# Altium project HumanoidMC_Project.PrjPcb
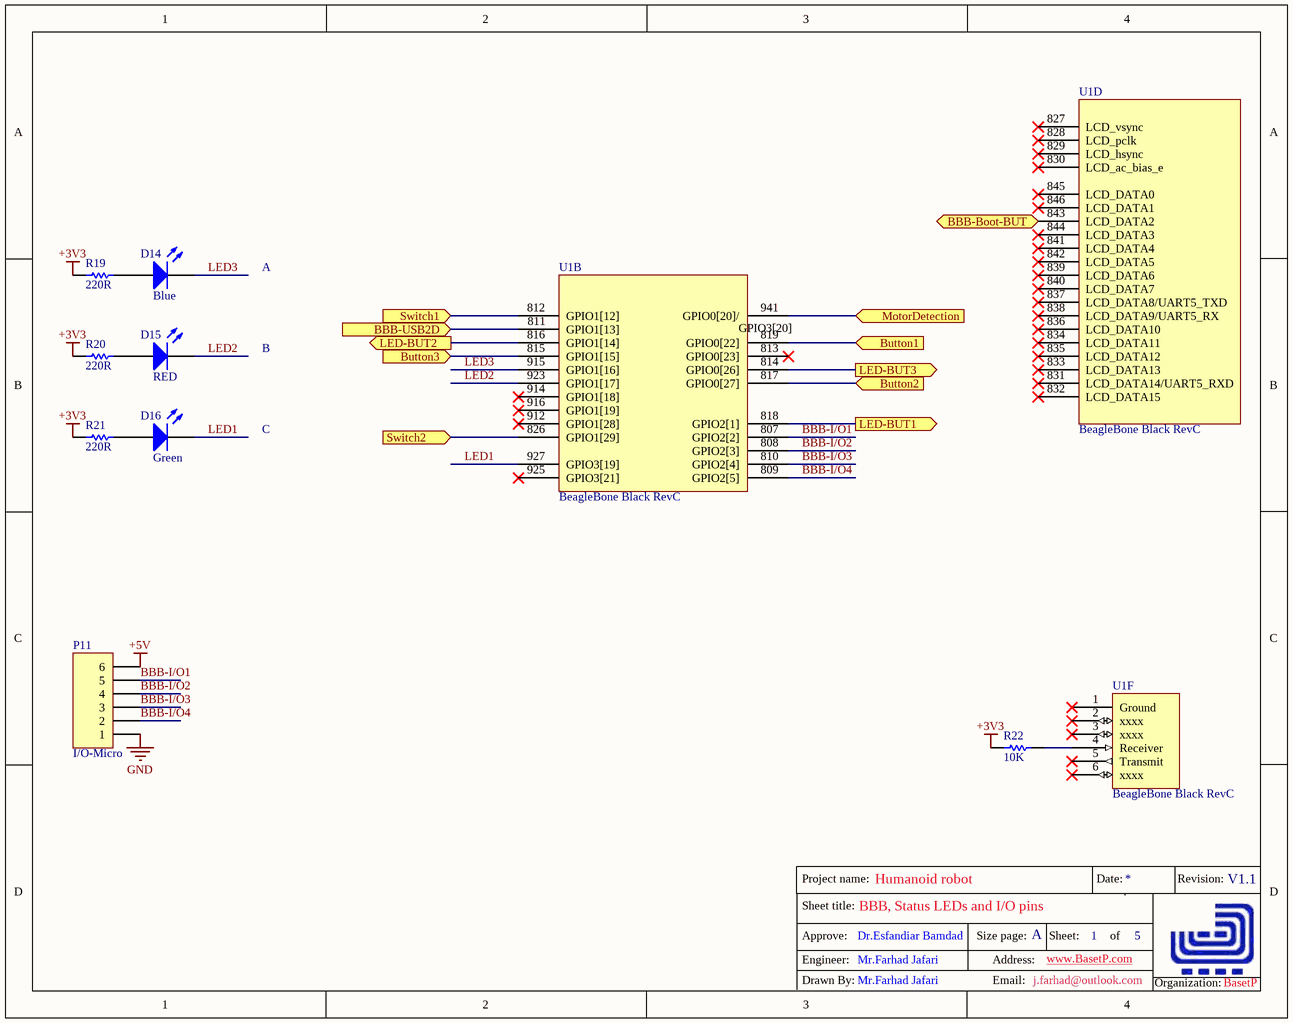
[diagram p0: Main sheet.SchDoc]
5 sheets, 135 parts. Net scope: flat (ports and power ports of the same name join across sheets).
Board file: MainController.PcbDoc
Sheets:
  Main sheet.SchDoc
  Communication sheet.SchDoc
  Switch sheet.SchDoc
  Extension sheet.SchDoc
  Power sheet.SchDoc

## Sheet Main sheet.SchDoc: BBB, Status LEDs and I/O pins
size A; DrawnBy: Mr.Farhad Jafari; Engineer: Mr.Farhad Jafari; Address1: www.BasetP.com; Address2: www.BasetP.com; Address3: www.BasetP.com; Address4: www.BasetP.com; Revision: V1.1; SheetNumber: 1; SheetTotal: 5; ProjectName: Humanoid robot

### Parts
D14  Blue  [led Blue-0805]
D15  RED  [LED Red-0805]
D16  Green  [LED Green-0805]
P11  I/O-Micro  [HDR1X6]
R19  220R  [6-0805]
R20  220R  [6-0805]
R21  220R  [6-0805]
R22  10K  [6-0805]
U1  BeagleBone Black RevC  [BBB-C]  (parts B,D,F of 6)

### Ports
BBB-Boot-BUT (in), BBB-USB2D (in), Button1 (in), Button2 (in), Button3 (in), LED-BUT1 (out), LED-BUT2 (out), LED-BUT3 (out), MotorDetection (in), Switch1 (in), Switch2 (in)

### Nets
+3V3: R19.1 R20.1 R21.1 R22.1
+5V: P11.6
GND: P11.1
BBB-I/O1: P11.5 U1.807(GPIO2[2])
BBB-I/O2: P11.4 U1.808(GPIO2[3])
BBB-I/O3: P11.3 U1.810(GPIO2[4])
BBB-I/O4: P11.2 U1.809(GPIO2[5])
LED1: D16.2(K) U1.927(GPIO3[19])
LED2: D15.2(K) U1.923(GPIO1[17])
LED3: D14.2(K) U1.915(GPIO1[16])
NetC21_2: U1.819(GPIO0[22]) ; port Button1
NetC22_2: U1.817(GPIO0[27]) ; port Button2
NetC23_2: U1.815(GPIO1[15]) ; port Button3
NetD14_1: D14.1(A) R19.2
NetD15_1: D15.1(A) R20.2
NetD16_1: D16.1(A) R21.2
NetD24_2: U1.818(GPIO2[1]) ; port LED-BUT1
NetD26_2: U1.816(GPIO1[14]) ; port LED-BUT2
NetD27_2: U1.814(GPIO0[26]) ; port LED-BUT3
NetQ2_3: U1.941(GPIO0[20]/) ; port MotorDetection
NetR22_2: R22.2 U1.4(Receiver)
NetR48_1: U1.843(LCD_DATA2) ; port BBB-Boot-BUT
NetS3_2: U1.811(GPIO1[13]) ; port BBB-USB2D
NetS5_2: U1.812(GPIO1[12]) ; port Switch1
NetS7_2: U1.826(GPIO1[29]) ; port Switch2

Not connected (* = marked no-connect by the designer): U1 1(Ground)* 2(xxxx)* 3(xxxx)* 5(Transmit)* 6(xxxx)* 813(GPIO0[23])* 827(LCD_vsync)* 828(LCD_pclk)* 829(LCD_hsync)* 830(LCD_ac_bias_e)* 831(LCD_DATA14/UART5_RXD)* 832(LCD_DATA15)* 833(LCD_DATA13)* 834(LCD_DATA11)* 835(LCD_DATA12)* 836(LCD_DATA10)* 837(LCD_DATA8/UART5_TXD)* 838(LCD_DATA9/UART5_RX)* 839(LCD_DATA6)* 840(LCD_DATA7)* 841(LCD_DATA4)* 842(LCD_DATA5)* 844(LCD_DATA3)* 845(LCD_DATA0)* 846(LCD_DATA1)* 912(GPIO1[28])* 914(GPIO1[18])* 916(GPIO1[19])* 925(GPIO3[21])*

### Notes on the sheet
- A
- B
- C
- Sheet title:
- Project name:
- Date:
- Revision:
- Engineer:
- Approve:
- Dr.Esfandiar Bamdad
- Size page:
- Address:
- www.BasetP.com
- Sheet:
- of
- Drawn By:
- Mr.Farhad Jafari
- Email:
- j.farhad@outlook.com
- Organization:
- BasetP
- (in symbol BeagleBoneBlackRevC, part B) GPIO3[20]

### Library data of the parts
D14 = LED-BLUE: High Performance Chip LED, Amber; LuminousIntensity: 25mcd (Minimum).; PCB_Layout: Complies with manufacturer's recommendation.; Published: 11-Dec-2002; DatasheetDocument: 11-Mar-2002; PackageDocument: 29-Oct-2001; PackageReference: 2.0X1.25X0.8; Publisher: Altium Limited; LED_Colour: Amber; ComponentLink1Description: Manufacturer Link; ComponentLink1URL: http://www.agilent.com/; ComponentLink2Description: Datasheet; ComponentLink2URL: http://cp.literature.agilent.com/litweb/pdf/5988-5891EN.pdf
D15 = LED-RED: High Performance Chip LED, Amber; LuminousIntensity: 25mcd (Minimum).; PCB_Layout: Complies with manufacturer's recommendation.; Published: 11-Dec-2002; DatasheetDocument: 11-Mar-2002; PackageDocument: 29-Oct-2001; PackageReference: 2.0X1.25X0.8; Publisher: Altium Limited; LED_Colour: Amber; ComponentLink1Description: Manufacturer Link; ComponentLink1URL: http://www.agilent.com/; ComponentLink2Description: Datasheet; ComponentLink2URL: http://cp.literature.agilent.com/litweb/pdf/5988-5891EN.pdf
D16 = LED-GREEN: High Performance Chip LED, Amber; LuminousIntensity: 25mcd (Minimum).; PCB_Layout: Complies with manufacturer's recommendation.; Published: 11-Dec-2002; DatasheetDocument: 11-Mar-2002; PackageDocument: 29-Oct-2001; PackageReference: 2.0X1.25X0.8; Publisher: Altium Limited; LED_Colour: Amber; ComponentLink1Description: Manufacturer Link; ComponentLink1URL: http://www.agilent.com/; ComponentLink2Description: Datasheet; ComponentLink2URL: http://cp.literature.agilent.com/litweb/pdf/5988-5891EN.pdf
P11 = Header 6: Header, 6-Pin; LatestRevisionDate: 17-Jul-2002; LatestRevisionNote: Re-released for DXP Platform.; Publisher: Altium Limited
R19-R22 = ERJ6RS: Low Ohmic Value Thick Film Chip Resistor, 0.1 Ohm to 0.2 Ohm Range, 1%, 2% and 5% Tolerance, 0805 Size, 0.125 W; Published: 17-Dec-2003; LatestRevisionDate: 19-Mar-2004; LatestRevisionNote: Silkscreen size reduced.; PackageDocument: Mar-2003; PackageReference: 6-0805; Publisher: Altium Limited; Code_IPC: 2012 [0805]; ComponentLink1Description: Manufacturer Link; ComponentLink1URL: http://www.panasonic.com/industrial/components/resistive_products.htm; ComponentLink2Description: Datasheet; ComponentLink2URL: http://www.panasonic.com/industrial/components/pdf/AOA0000CE3.pdf
U1 = BeagleBoneBlackRevC

## Sheet Communication sheet.SchDoc: Rs-485 and I2C
size A; DrawnBy: Mr.Farhad Jafari; Engineer: Mr.Farhad Jafari; Address1: www.BasetP.com; Address2: www.BasetP.com; Address3: www.BasetP.com; Address4: www.BasetP.com; Revision: V1.1; SheetNumber: 2; SheetTotal: 5; ProjectName: Humanoid robot
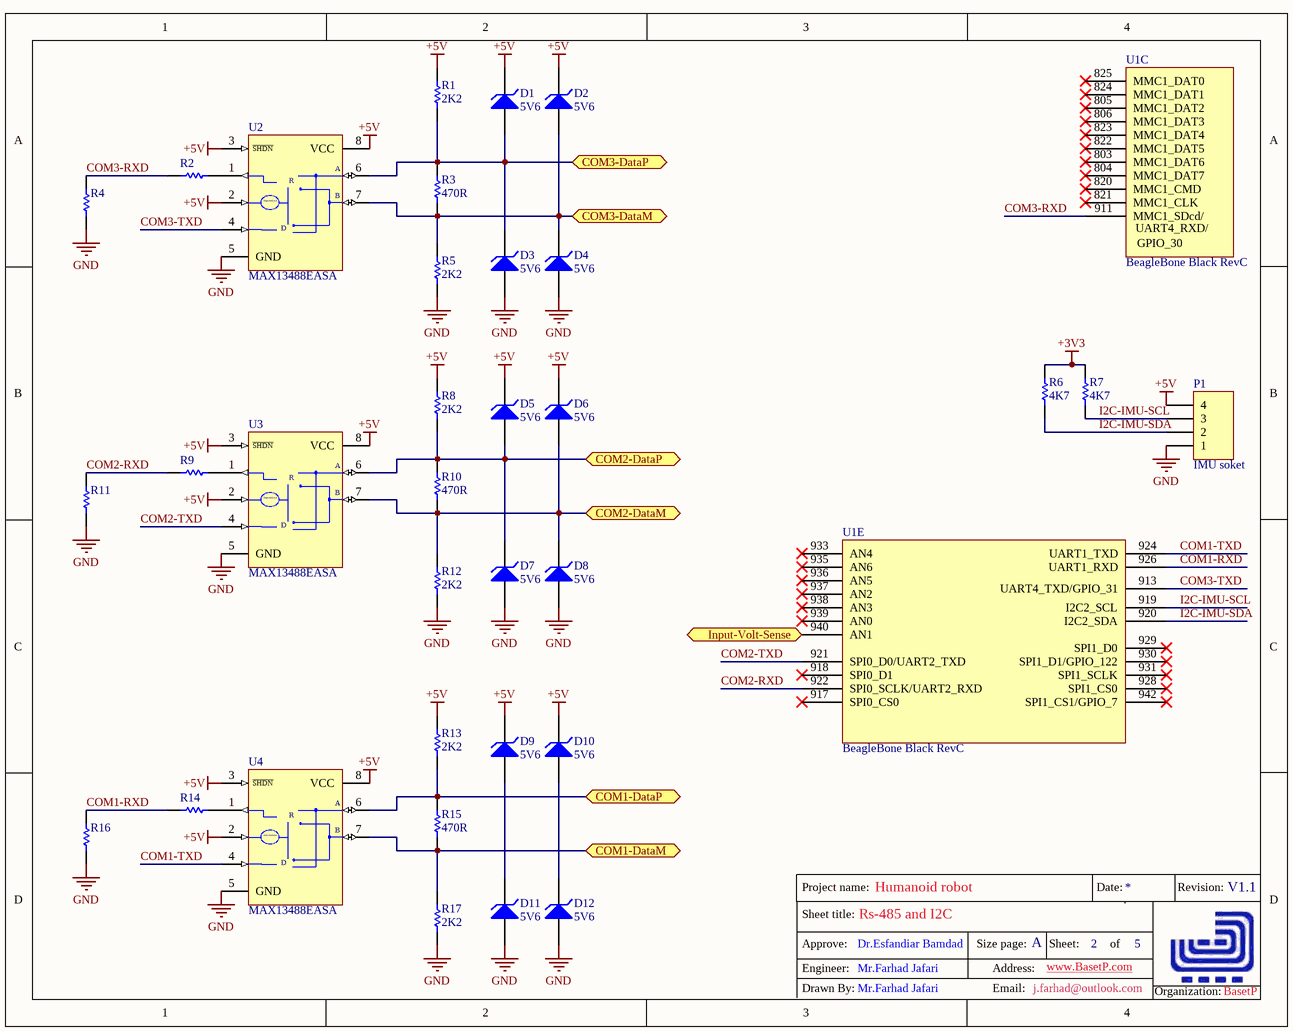
[diagram p1: Communication sheet.SchDoc]

### Parts
D1  5V6  [diode-0.4]
D2  5V6  [diode-0.4]
D3  5V6  [diode-0.4]
D4  5V6  [diode-0.4]
D5  5V6  [diode-0.4]
D6  5V6  [diode-0.4]
D7  5V6  [diode-0.4]
D8  5V6  [diode-0.4]
D9  5V6  [diode-0.4]
D10  5V6  [diode-0.4]
D11  5V6  [diode-0.4]
D12  5V6  [diode-0.4]
P1  IMU soket  [HDR1X4]
R1  2K2  [6-0805]
R2  620  [6-0805]  (value not drawn)
R3  470R  [6-0805]
R4  1K  [6-0805]  (value not drawn)
R5  2K2  [6-0805]
R6  4K7  [6-0805]
R7  4K7  [6-0805]
R8  2K2  [6-0805]
R9  680R  [6-0805]  (value not drawn)
R10  470R  [6-0805]
R11  1K  [6-0805]  (value not drawn)
R12  2K2  [6-0805]
R13  2K2  [6-0805]
R14  680R  [6-0805]  (value not drawn)
R15  470R  [6-0805]
R16  1K  [6-0805]  (value not drawn)
R17  2K2  [6-0805]
U1  BeagleBone Black RevC  [BBB-C]  (parts C,E of 6)
U2  MAX13488EASA  [NSO8_N]
U3  MAX13488EASA  [NSO8_N]
U4  MAX13488EASA  [NSO8_N]

### Ports
COM1-DataM, COM1-DataP, COM2-DataM, COM2-DataP, COM3-DataM, COM3-DataP, Input-Volt-Sense (in)

### Nets
+3V3: R6.1 R7.1
+5V: D1.2(K) D2.2(K) D5.2(K) D6.2(K) D9.2(K) D10.2(K) P1.4 R1.1 R8.1 R13.1 U2.2(~{RE}) U2.3(~{SHDN}) U2.8(VCC) U3.2(~{RE}) U3.3(~{SHDN}) U3.8(VCC) U4.2(~{RE}) U4.3(~{SHDN}) U4.8(VCC)
GND: D3.1(A) D4.1(A) D7.1(A) D8.1(A) D11.1(A) D12.1(A) P1.1 R4.1 R5.2 R11.2 R12.2 R16.1 R17.2 U2.5(GND) U3.5(GND) U4.5(GND)
COM1-DataM: R15.2 R17.1 U4.7(B) ; port COM1-DataM
COM1-DataP: R13.2 R15.1 U4.6(A) ; port COM1-DataP
COM1-RXD: R14.1 R16.2 U1.926(UART1_RXD)
COM1-TXD: U1.924(UART1_TXD) U4.4(DI)
COM2-DataM: D6.1(A) D8.2(K) R10.2 R12.1 U3.7(B) ; port COM2-DataM
COM2-DataP: D5.1(A) D7.2(K) R8.2 R10.1 U3.6(A) ; port COM2-DataP
COM2-RXD: R9.2 R11.1 U1.922(SPI0_SCLK/UART2_RXD)
COM2-TXD: U1.921(SPI0_D0/UART2_TXD) U3.4(DI)
COM3-DataM: D2.1(A) D4.2(K) R3.2 R5.1 U2.7(B) ; port COM3-DataM
COM3-DataP: D1.1(A) D3.2(K) R1.2 R3.1 U2.6(A) ; port COM3-DataP
COM3-RXD: R2.1 R4.2 U1.911(MMC1_SDcd/)
COM3-TXD: U1.913(UART4_TXD/GPIO_31) U2.4(DI)
I2C-IMU-SCL: P1.3 R7.2 U1.919(I2C2_SCL)
I2C-IMU-SDA: P1.2 R6.2 U1.920(I2C2_SDA)
NetD9_1: D9.1(A) D11.2(K)
NetD10_1: D10.1(A) D12.2(K)
NetD50_2: U1.940(AN1) ; port Input-Volt-Sense
NetR2_2: R2.2 U2.1(RO)
NetR9_1: R9.1 U3.1(RO)
NetR14_2: R14.2 U4.1(RO)

Not connected (* = marked no-connect by the designer): U1 803(MMC1_DAT6)* 804(MMC1_DAT7)* 805(MMC1_DAT2)* 806(MMC1_DAT3)* 820(MMC1_CMD)* 821(MMC1_CLK)* 822(MMC1_DAT5)* 823(MMC1_DAT4)* 824(MMC1_DAT1)* 825(MMC1_DAT0)* 917(SPI0_CS0)* 918(SPI0_D1)* 928(SPI1_CS0)* 929(SPI1_D0)* 930(SPI1_D1/GPIO_122)* 931(SPI1_SCLK)* 933(AN4)* 935(AN6)* 936(AN5)* 937(AN2)* 938(AN3)* 939(AN0)* 942(SPI1_CS1/GPIO_7)*

### Notes on the sheet
- Sheet title:
- Project name:
- Date:
- Revision:
- Engineer:
- Approve:
- Dr.Esfandiar Bamdad
- Size page:
- Address:
- A
- www.BasetP.com
- Sheet:
- of
- Drawn By:
- Mr.Farhad Jafari
- Email:
- j.farhad@outlook.com
- Organization:
- BasetP
- (in symbol BeagleBoneBlackRevC, part C) UART4_RXD/; GPIO_30
- (in symbol MAX13488EASA) R; State machine; D

### Library data of the parts
D1-D12 = D Zener: Zener Diode; Published: 8-Jun-2000; LatestRevisionDate: 17-Jul-2002; LatestRevisionNote: Re-released for DXP Platform.; PackageReference: DIODE-0.7; Publisher: Altium Limited; PackageDescription: Diode, Thru-Hole; 2 Leads; 0.7 in Pin Spacing
P1 = Header 4: Header, 4-Pin; LatestRevisionDate: 17-Jul-2002; LatestRevisionNote: Re-released for DXP Platform.; Publisher: Altium Limited
R1-R17 = ERJ6RS: as R19 on sheet Main sheet; Published: 17-Dec-2003; LatestRevisionDate: 19-Mar-2004; LatestRevisionNote: Silkscreen size reduced.; PackageDocument: Mar-2003; PackageReference: 6-0805; Publisher: Altium Limited; Code_IPC: 2012 [0805]; ComponentLink1Description: Manufacturer Link; ComponentLink1URL: http://www.panasonic.com/industrial/components/resistive_products.htm; ComponentLink2Description: Datasheet; ComponentLink2URL: http://www.panasonic.com/industrial/components/pdf/AOA0000CE3.pdf
U1 = BeagleBoneBlackRevC
U2-U4 = MAX13488EASA: Low-Power,  RS-485/RS-422 Transceiver, Auto direciton; Published: 7-May-2015; LatestRevisionNote: IPC-7351 Footprint Added.; PackageReference: NSO8; Publisher: Farhad Jafari; PackageDescription: 8-Pin Small Outline Integrated Circuit 1.27 mm Pitch; Code_JEDEC: MS-012-AA; Code_IPC: SOIC127P600-8; ComponentLink1Description: Manufacturer Link; ComponentLink1URL: http://www.maxim-ic.com/

## Sheet Switch sheet.SchDoc: Reset, Boot and control switchs
size A; DrawnBy: Mr.Farhad Jafari; Engineer: Mr.Farhad Jafari; Address1: www.BasetP.com; Address2: www.BasetP.com; Address3: www.BasetP.com; Address4: www.BasetP.com; Revision: V1.1; SheetNumber: 4; SheetTotal: 5; ProjectName: Humanoid robot
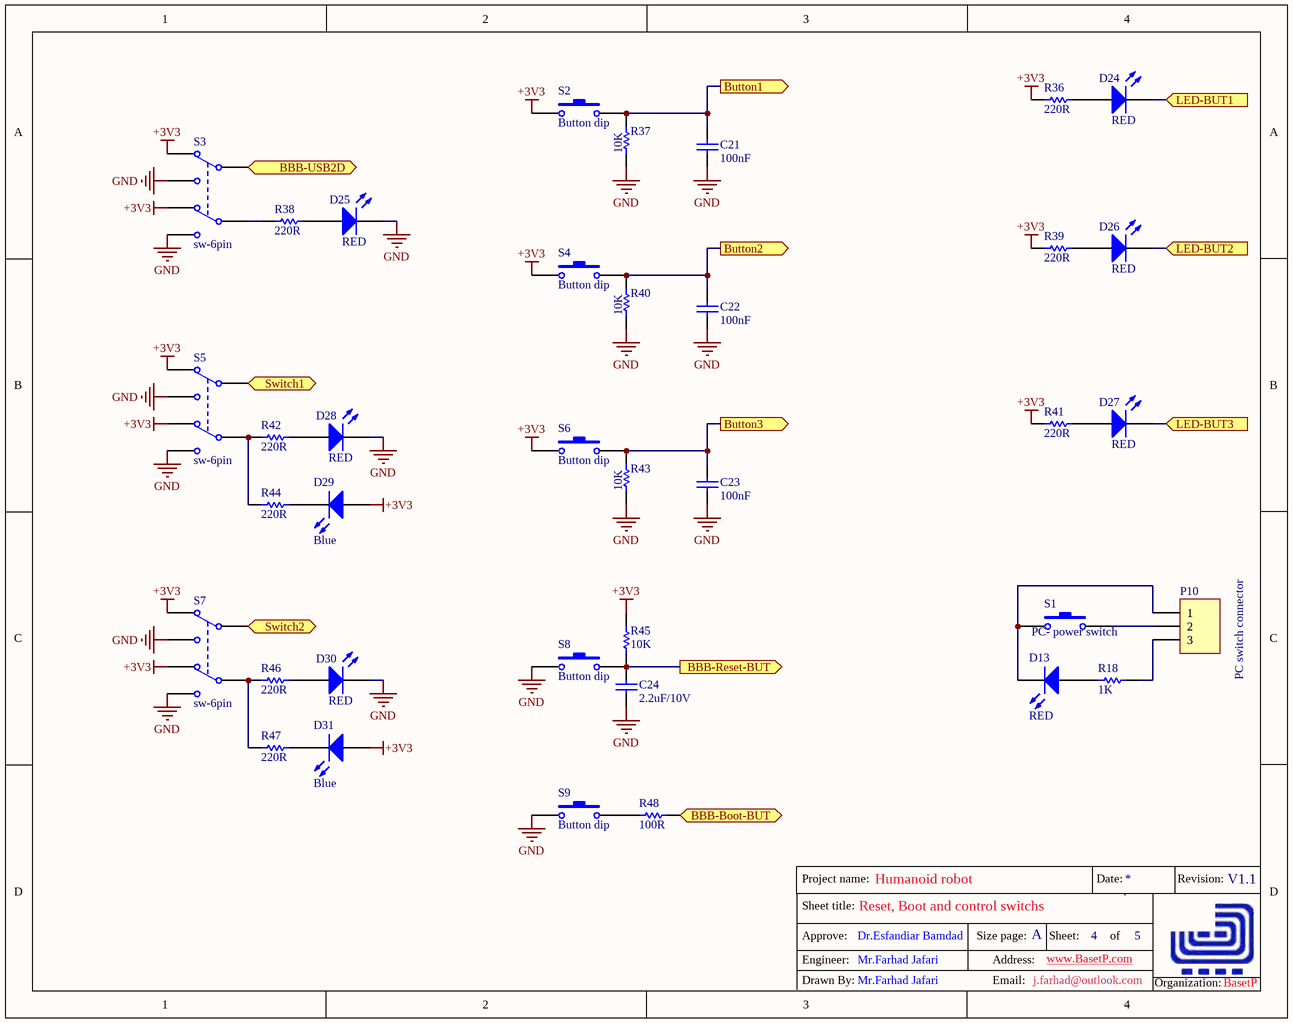
[diagram p2: Switch sheet.SchDoc]

### Parts
C21  value 100nF  [0805]  (hidden comment: C0805)
C22  value 100nF  [0805]  (hidden comment: C0805)
C23  value 100nF  [0805]  (hidden comment: C0805)
C24  value 2.2uF/10V  [0805]  (hidden comment: C0805)
D13  RED  [LED Red-0805]
D24  RED  [LED Red-0805]
D25  RED  [LED Red-0805]
D26  RED  [LED Red-0805]
D27  RED  [LED Red-0805]
D28  RED  [LED Red-0805]
D29  Blue  [led Blue-0805]
D30  RED  [LED Red-0805]
D31  Blue  [led Blue-0805]
P10  PC switch connector  [HDR1X3]
R18  1K  [6-0805]
R36  220R  [6-0805]
R37  10K  [6-0805]
R38  220R  [6-0805]
R39  220R  [6-0805]
R40  10K  [6-0805]
R41  220R  [6-0805]
R42  220R  [6-0805]
R43  10K  [6-0805]
R44  220R  [6-0805]
R45  10K  [6-0805]
R46  220R  [6-0805]
R47  220R  [6-0805]
R48  100R  [6-0805]
S1  PC- power switch  [DTS-6x]
S2  Button dip  [DTS-6x]
S3  sw-6pin  [sw-6pin]
S4  Button dip  [DTS-6x]
S5  sw-6pin  [sw-6pin]
S6  Button dip  [DTS-6x]
S7  sw-6pin  [sw-6pin]
S8  Button dip  [DTS-6x]
S9  Button dip  [DTS-6x]

### Ports
BBB-Boot-BUT (out), BBB-Reset-BUT (out), BBB-USB2D (out), Button1 (out), Button2 (out), Button3 (out), LED-BUT1 (in), LED-BUT2 (in), LED-BUT3 (in), Switch1 (out), Switch2 (out)

### Nets
+3V3: D29.1(A) D31.1(A) R36.1 R39.1 R41.1 R45.2 S2.1 S3.1(NC1) S3.6(NC2) S4.1 S5.1(NC1) S5.6(NC2) S6.1 S7.1(NC1) S7.6(NC2)
GND: C21.1 C22.1 C23.1 C24.1 D25.2(K) D28.2(K) D30.2(K) R37.1 R40.1 R43.1 S3.3(NO1) S3.4(NO2) S5.3(NO1) S5.4(NO2) S7.3(NO1) S7.4(NO2) S8.1 S9.1
NetC21_2: C21.2 R37.2 S2.2 ; port Button1
NetC22_2: C22.2 R40.2 S4.2 ; port Button2
NetC23_2: C23.2 R43.2 S6.2 ; port Button3
NetC24_2: C24.2 R45.1 S8.2 ; port BBB-Reset-BUT
NetD13_1: D13.1(A) R18.2
NetD13_2: D13.2(K) P10.1 S1.1
NetD24_1: D24.1(A) R36.2
NetD24_2: D24.2(K) ; port LED-BUT1
NetD25_1: D25.1(A) R38.2
NetD26_1: D26.1(A) R39.2
NetD26_2: D26.2(K) ; port LED-BUT2
NetD27_1: D27.1(A) R41.2
NetD27_2: D27.2(K) ; port LED-BUT3
NetD28_1: D28.1(A) R42.2
NetD29_2: D29.2(K) R44.2
NetD30_1: D30.1(A) R46.2
NetD31_2: D31.2(K) R47.2
NetP10_2: P10.2 S1.2
NetP10_3: P10.3 R18.1
NetR38_1: R38.1 S3.5(COMMON2)
NetR42_1: R42.1 R44.1 S5.5(COMMON2)
NetR46_1: R46.1 R47.1 S7.5(COMMON2)
NetR48_1: R48.1 ; port BBB-Boot-BUT
NetR48_2: R48.2 S9.2
NetS3_2: S3.2(COMMON1) ; port BBB-USB2D
NetS5_2: S5.2(COMMON1) ; port Switch1
NetS7_2: S7.2(COMMON1) ; port Switch2

### Notes on the sheet
- Sheet title:
- Project name:
- Date:
- Revision:
- Engineer:
- Approve:
- Dr.Esfandiar Bamdad
- Size page:
- Address:
- A
- www.BasetP.com
- Sheet:
- of
- Drawn By:
- Mr.Farhad Jafari
- Email:
- j.farhad@outlook.com
- Organization:
- BasetP

### Library data of the parts
C21-C24 = C0805: Ceramic Chip Capacitor - Standard; Note: Footprint corresponds to dimensions for bulk cassette packaging. This case size has tightened tolerances.; Published: 17-Jul-2002; LatestRevisionDate: 19-Mar-2004; LatestRevisionNote: Silkscreen size reduced.; DatasheetDocument: Mar-2001; PackageDocument: Mar-2001; PackageReference: 0805; Publisher: Altium Limited; Code_JEITA: 0805; Code_IPC: 2012[0805]; ComponentLink1Description: Manufacturer Link; ComponentLink1URL: http://www.kemet.com/; ComponentLink2Description: Datasheet; ComponentLink2URL: http://www.kemet.com/kemet/web/homepage/kechome.nsf/vapubfilesname/F3102TA.pdf/$file/F3102TA.pdf
D13 D24-D28 D30 = LED-RED: as D15 on sheet Main sheet; Published: 11-Dec-2002; PackageReference: 2.0X1.25X0.8; Publisher: Altium Limited; LED_Colour: Amber; ComponentLink1Description: Manufacturer Link; ComponentLink1URL: http://www.agilent.com/; ComponentLink2Description: Datasheet; ComponentLink2URL: http://cp.literature.agilent.com/litweb/pdf/5988-5891EN.pdf; DatasheetDocument: 11-Mar-2002; PackageDocument: 29-Oct-2001
D29 D31 = LED-BLUE: as D14 on sheet Main sheet; Published: 11-Dec-2002; DatasheetDocument: 11-Mar-2002; PackageDocument: 29-Oct-2001; PackageReference: 2.0X1.25X0.8; Publisher: Altium Limited; LED_Colour: Amber; ComponentLink1Description: Manufacturer Link; ComponentLink1URL: http://www.agilent.com/; ComponentLink2Description: Datasheet; ComponentLink2URL: http://cp.literature.agilent.com/litweb/pdf/5988-5891EN.pdf
P10 = Header 3: Header, 3-Pin; LatestRevisionDate: 17-Jul-2002; LatestRevisionNote: Re-released for DXP Platform.; Publisher: Altium Limited
R18 R36-R48 = ERJ6RS: as R19 on sheet Main sheet; Published: 17-Dec-2003; LatestRevisionDate: 19-Mar-2004; LatestRevisionNote: Silkscreen size reduced.; PackageDocument: Mar-2003; PackageReference: 6-0805; Publisher: Altium Limited; Code_IPC: 2012 [0805]; ComponentLink1Description: Manufacturer Link; ComponentLink1URL: http://www.panasonic.com/industrial/components/resistive_products.htm; ComponentLink2Description: Datasheet; ComponentLink2URL: http://www.panasonic.com/industrial/components/pdf/AOA0000CE3.pdf
S1 S2 S4 S6 S8 S9 = Button dip: Switch

## Sheet Extension sheet.SchDoc: Extension serials
size A; DrawnBy: Mr.Farhad Jafari; Engineer: Mr.Farhad Jafari; Address1: www.BasetP.com; Address2: www.BasetP.com; Address3: www.BasetP.com; Address4: www.BasetP.com; Revision: V1.1; SheetNumber: 4; SheetTotal: 5; ProjectName: Humanoid robot
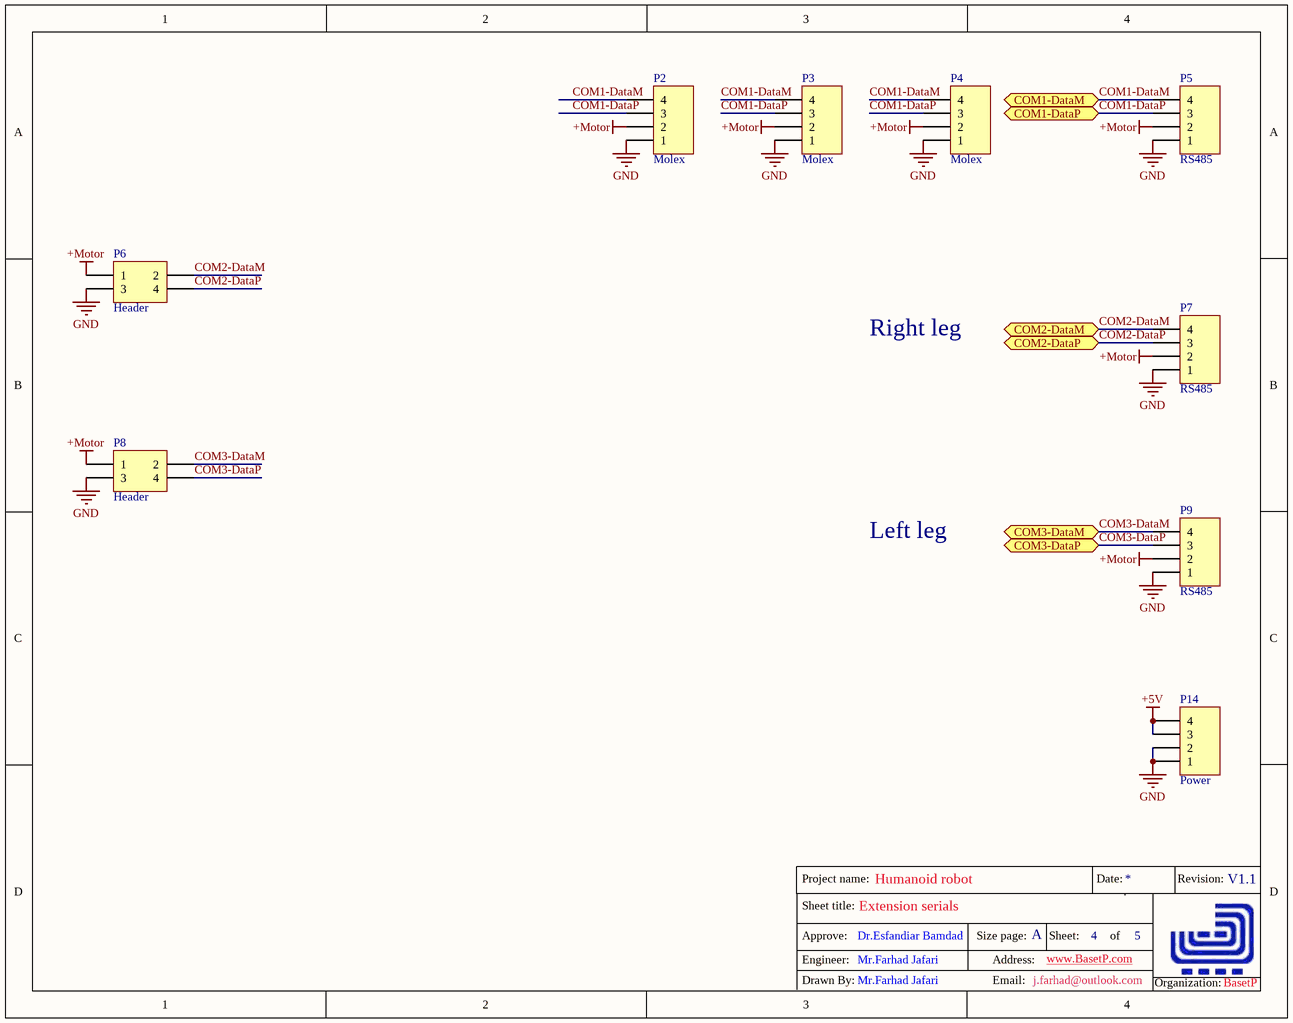
[diagram p3: Extension sheet.SchDoc]

### Parts
P2  Molex  [HDR1*4]
P3  Molex  [HDR1*4]
P4  Molex  [HDR1*4]
P5  RS485  [HDR1*4]
P6  Header  [connector 2*2]
P7  RS485  [HDR1*4]
P8  Header  [connector 2*2]
P9  RS485  [HDR1*4]
P14  Power  [HDR1X4]

### Ports
COM1-DataM, COM1-DataP, COM2-DataM, COM2-DataP, COM3-DataM, COM3-DataP

### Nets
+5V: P14.3 P14.4
+Motor: P2.2 P3.2 P4.2 P5.2 P6.1 P7.2 P8.1 P9.2
GND: P2.1 P3.1 P4.1 P5.1 P6.3 P7.1 P8.3 P9.1 P14.1 P14.2
COM1-DataM: P2.4 P3.4 P4.4 P5.4 ; port COM1-DataM
COM1-DataP: P2.3 P3.3 P4.3 P5.3 ; port COM1-DataP
COM2-DataM: P6.2 P7.4 ; port COM2-DataM
COM2-DataP: P6.4 P7.3 ; port COM2-DataP
COM3-DataM: P8.2 P9.4 ; port COM3-DataM
COM3-DataP: P8.4 P9.3 ; port COM3-DataP

### Notes on the sheet
- Right leg
- Left leg
- Sheet title:
- Project name:
- Date:
- Revision:
- Engineer:
- Approve:
- Dr.Esfandiar Bamdad
- Size page:
- Address:
- A
- www.BasetP.com
- Sheet:
- of
- Drawn By:
- Mr.Farhad Jafari
- Email:
- j.farhad@outlook.com
- Organization:
- BasetP

### Library data of the parts
P2-P5 P7 P9 = Molex 4pin: Molex pin circular
P6 P8 = Header 2X2 right angle: Header, 4-Pin, 2X2 right angle; LatestRevisionDate: 17-Jul-2002; LatestRevisionNote: Re-released for DXP Platform.; Publisher: Altium Limited
P14 = Header 4: Header, 4-Pin; LatestRevisionDate: 17-Jul-2002; LatestRevisionNote: Re-released for DXP Platform.; Publisher: Altium Limited

## Sheet Power sheet.SchDoc: Power management
size A; DrawnBy: Mr.Farhad Jafari; Engineer: Mr.Farhad Jafari; Address1: www.BasetP.com; Address2: www.BasetP.com; Address3: www.BasetP.com; Address4: www.BasetP.com; Revision: V1.1; SheetNumber: 5; SheetTotal: 5; ProjectName: Adult humanoid robot
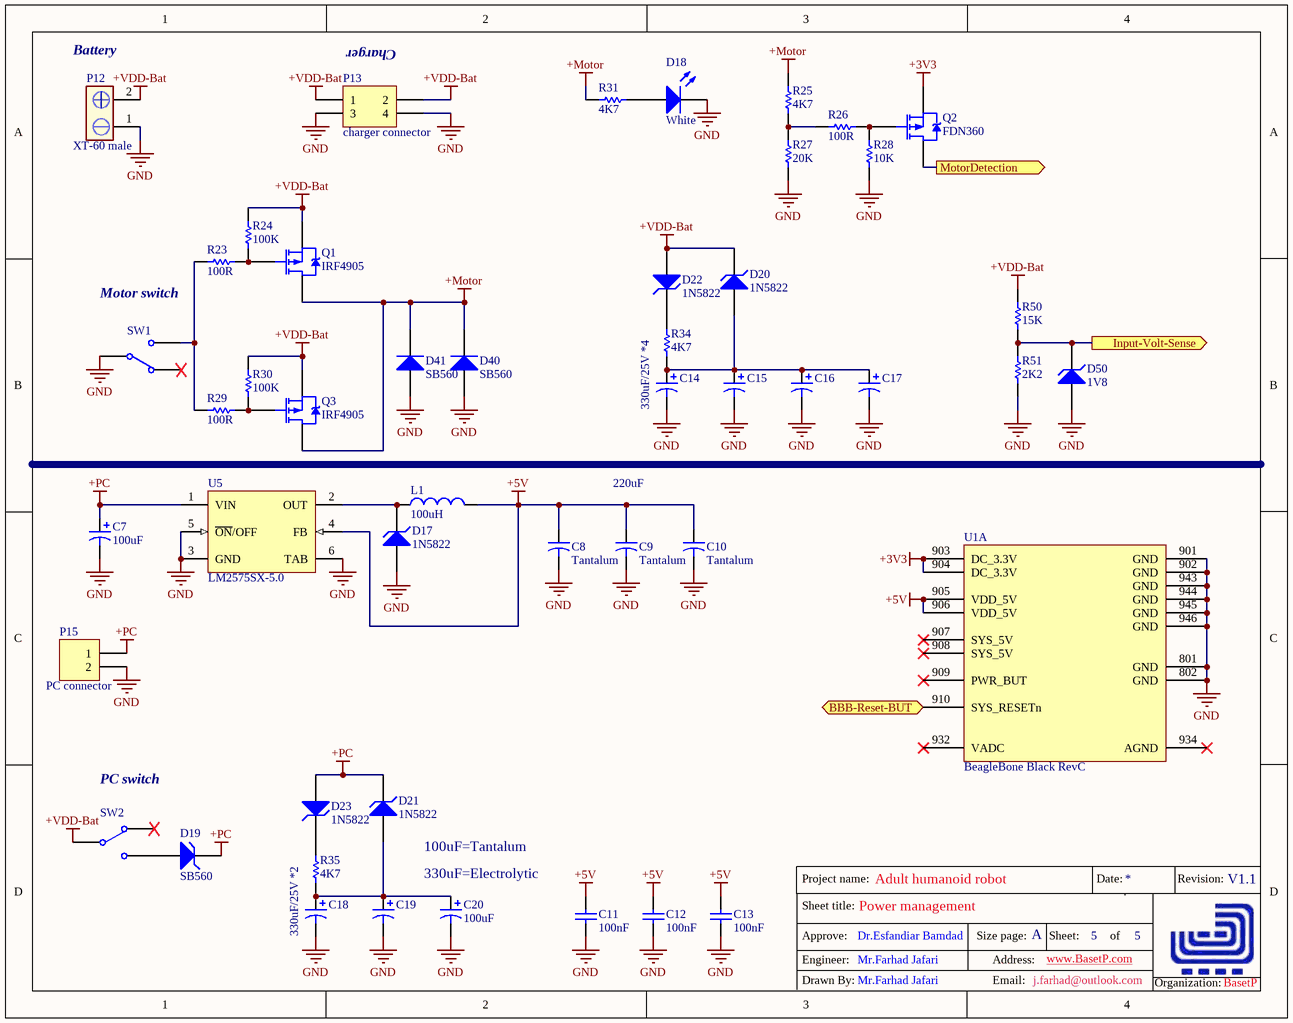
[diagram p4: Power sheet.SchDoc]

### Parts
C7  100uF  [B]
C8  Tantalum  [tantalum E]
C9  Tantalum  [tantalum E]
C10  Tantalum  [tantalum E]
C11  value 100nF  [0805]  (hidden comment: C0805)
C12  value 100nF  [0805]  (hidden comment: C0805)
C13  value 100nF  [0805]  (hidden comment: C0805)
C14  330uF/25V *4  [E']
C15  330uF/25V  [E']  (value not drawn)
C16  330uF/25V  [E']  (value not drawn)
C17  330uF/25V  [E']  (value not drawn)
C18  330uF/25V *2  [E']
C19  `  [E']  (value not drawn)
C20  100uF  [C5]
D17  1N5822  [DL-41]
D18  White  [LED Red-0805]
D19  SB560  [DL-41]
D20  1N5822  [MELF]
D21  1N5822  [MELF]
D22  1N5822  [MELF]
D23  1N5822  [MELF]
D40  SB560  [DO-41]
D41  SB560  [DO-41]
D50  1V8  [MELF]
L1  100uH  [inductor coil]
P12  XT-60 male  [XT-60 connector]
P13  charger connector  [connector 2*2]
P15  PC connector  [connector 1*2]
Q1  IRF4905  [TO-220AB]
Q2  FDN360  [SOT-23B_L]
Q3  IRF4905  [TO-220AB]
R23  100R  [6-0805]
R24  100K  [6-0805]
R25  4K7  [6-0805]
R26  100R  [6-0805]
R27  20K  [6-0805]
R28  10K  [6-0805]
R29  100R  [6-0805]
R30  100K  [6-0805]
R31  4K7  [6-0805]
R34  4K7  [8RB-1206]
R35  4K7  [8RB-1206]
R50  15K  [6-0805]
R51  2K2  [6-0805]
SW1  switch Red  [SW-power3A]  (value not drawn)
SW2  switch Red  [SW-power3A]  (value not drawn)
U1  BeagleBone Black RevC  [BBB-C]  (part A of 6)
U5  LM2575SX-5.0  [TS5B_N]

### Ports
BBB-Reset-BUT (in), Input-Volt-Sense (out), MotorDetection (out)

### Nets
+3V3: Q2.2(S) U1.903(DC_3.3V) U1.904(DC_3.3V)
+5V: C8.1 C9.1 C10.1 C11.2 C12.2 C13.2 L1.2 U1.905(VDD_5V) U1.906(VDD_5V) U5.4(FB)
+Motor: D40.2(K) D41.2(K) Q1.2(D) Q3.2(D) R25.2 R31.1
+PC: C7.1 D19.2(K) D21.2(K) D23.1(A) P15.1 U5.1(VIN)
+VDD-Bat: D20.2(K) D22.1(A) P12.2 P13.1 P13.2 Q1.3(S) Q3.3(S) R24.1 R30.2 R50.2 SW2.2(COMMON1)
GND: C7.2 C8.2 C9.2 C10.2 C11.1 C12.1 C13.1 C14.2 C15.2 C16.2 C17.2 C18.2 C19.2 C20.2 D17.1(A) D18.2(K) D40.1(A) D41.1(A) D50.1(A) P12.1 P13.3 P13.4 P15.2 R27.1 R28.1 R51.1 SW1.2(COMMON1) U1.801(GND) U1.802(GND) U1.901(GND) U1.902(GND) U1.943(GND) U1.944(GND) U1.945(GND) U1.946(GND) U5.3(GND) U5.5(~{ON}/OFF) U5.6(TAB)
NetC14_1: C14.1 C15.1 C16.1 C17.1 D20.1(A) R34.1
NetC18_1: C18.1 C19.1 C20.1 D21.1(A) R35.1
NetC24_2: U1.910(SYS_RESETn) ; port BBB-Reset-BUT
NetD17_2: D17.2(K) L1.1 U5.2(OUT)
NetD18_1: D18.1(A) R31.2
NetD19_1: D19.1(A) SW2.1(NO1)
NetD22_2: D22.2(K) R34.2
NetD23_2: D23.2(K) R35.2
NetD50_2: D50.2(K) R50.1 R51.2 ; port Input-Volt-Sense
NetQ1_1: Q1.1(G) R23.1 R24.2
NetQ2_1: Q2.1(G) R26.1 R28.2
NetQ2_3: Q2.3(D) ; port MotorDetection
NetQ3_1: Q3.1(G) R29.1 R30.1
NetR23_2: R23.2 R29.2 SW1.1(NO1)
NetR25_1: R25.1 R26.2 R27.2

Not connected (* = marked no-connect by the designer): U1 907(SYS_5V)* 908(SYS_5V)* 909(PWR_BUT)* 932(VADC)* 934(AGND)*

### Notes on the sheet
- (near P12) Battery
- (near P13) Charger
- Motor switch
- 220uF
- (near SW2) PC switch
- 100uF=Tantalum
- 330uF=Electrolytic
- Sheet title:
- Project name:
- Date:
- Revision:
- Engineer:
- Approve:
- Dr.Esfandiar Bamdad
- Size page:
- Address:
- A
- www.BasetP.com
- Sheet:
- of
- Drawn By:
- Mr.Farhad Jafari
- Email:
- j.farhad@outlook.com
- Organization:
- BasetP

### Library data of the parts
C7 = 100uF/25V: Solid Aluminum Capacitor with Organic Semiconductor Electrolyte: 10uF, 10V, Bulk Pack; Note: Part Numbers shown are for ± 20% capacitance tolerance (X0).; PCB_Layout: Complies with Manufacturer's Recommendation.; DrillSize: Nominal, Rounded to the nearest 0.1mm; Published: 19-Mar-2004; DatasheetDocument: 23-May-2001; PackageReference: B; Publisher: Altium Limited; ComponentLink1Description: Manufacturer Link; ComponentLink1URL: http://www.vishay.com/; ComponentLink2Description: Datasheet; ComponentLink2URL: http://www.vishay.com/docs/90004/94sc.pdf; Value: 10uF
C11-C13 = C0805: as C21 on sheet Switch sheet; Published: 17-Jul-2002; LatestRevisionDate: 19-Mar-2004; LatestRevisionNote: Silkscreen size reduced.; DatasheetDocument: Mar-2001; PackageDocument: Mar-2001; PackageReference: 0805; Publisher: Altium Limited; Code_JEITA: 0805; Code_IPC: 2012[0805]; ComponentLink1Description: Manufacturer Link; ComponentLink1URL: http://www.kemet.com/; ComponentLink2Description: Datasheet; ComponentLink2URL: http://www.kemet.com/kemet/web/homepage/kechome.nsf/vapubfilesname/F3102TA.pdf/$file/F3102TA.pdf
C14-C19 = 330uF/25V: Solid Aluminum Capacitor with Organic Semiconductor Electrolyte: 100uF, 6.3V, Bulk Pack; Note: Part Numbers shown are for ± 20% capacitance tolerance (X0).; PCB_Layout: Complies with Manufacturer's Recommendation.; DrillSize: Nominal, Rounded to the nearest 0.1mm; Published: 19-Mar-2004; DatasheetDocument: 23-May-2001; PackageReference: E'; Publisher: Altium Limited; ComponentLink1Description: Manufacturer Link; ComponentLink1URL: http://www.vishay.com/; ComponentLink2Description: Datasheet; ComponentLink2URL: http://www.vishay.com/docs/90005/94sl.pdf; Value: 100uF
C20 = STC68-15C5RM: Subminiature, Leaded Solid Tantalum Capacitor: Radial-Lead, Polarised, 68uF, 20% Tolerance, 15 WVDC @ +85°C; Note: See Data Sheet for full range of components; Published: 19-Mar-2004; DatasheetDocument: 13-Jun-2002; PackageReference: C5; Publisher: Altium Limited; ComponentLink1Description: Manufacturer Link; ComponentLink1URL: http://www.vishay.com/; ComponentLink2Description: Datasheet; ComponentLink2URL: http://www.vishay.com/docs/43006/stc.pdf; Value: 68uF
D17 D19 = 1N5822: High-Voltage Power schottky Diode; Published: 8-Jun-2000; LatestRevisionDate: 19-Mar-2004; LatestRevisionNote: Silkscreen size reduced.; DatasheetDocument: 16-May-1997; PackageDocument: May-1997; PackageReference: MELF; Publisher: Altium Limited; ComponentLink1Description: Manufacturer Link; ComponentLink1URL: http://www.vishay.com/
D18 = LED-RED: as D15 on sheet Main sheet; Published: 11-Dec-2002; PackageReference: 2.0X1.25X0.8; Publisher: Altium Limited; LED_Colour: Amber; ComponentLink1Description: Manufacturer Link; ComponentLink1URL: http://www.agilent.com/; ComponentLink2Description: Datasheet; ComponentLink2URL: http://cp.literature.agilent.com/litweb/pdf/5988-5891EN.pdf; DatasheetDocument: 11-Mar-2002; PackageDocument: 29-Oct-2001
D20-D23 D50 = ZMU100: High-Voltage Power Zener Diode; Published: 8-Jun-2000; LatestRevisionDate: 19-Mar-2004; LatestRevisionNote: Silkscreen size reduced.; DatasheetDocument: 16-May-1997; PackageDocument: May-1997; PackageReference: MELF; Publisher: Altium Limited; ComponentLink1Description: Manufacturer Link; ComponentLink1URL: http://www.vishay.com/
D40 D41 = Diode SB560: 1 Amp General Purpose Rectifier; Published: 8-Jun-2000; LatestRevisionDate: 17-Jul-2002; LatestRevisionNote: Re-released for DXP Platform.; DatasheetVersion: 1998; PackageVersion: Aug-1999; PackageReference: DO-41; Publisher: Altium Limited; PackageDescription: Diode, Axial; Body 5.2 x 2.7 mm (LxDia. max), Lead Dia. 0.86 mm (max); Code_JEDEC: DO-204-AL; ComponentLink1Description: Manufacturer Link; ComponentLink1URL: http://www.fairchildsemi.com/; ComponentLink2Description: Datasheet; ComponentLink2URL: http://www.fairchildsemi.com/ds/1N%2F1N4001.pdf
L1 = Inductor coil: Inductor coil  17mm * 9mm; Code_IEC: 1005; Published: 8-Jun-2000; LatestRevisionDate: 29-May-2009; LatestRevisionNote: IPC-7351 Footprint Added.; PackageReference: 0402-A; Publisher: Altium Limited; PackageDescription: Chip Inductor; Code_JEITA: 0402; Value: 100uH
P12 = XT-60 connector male: XT-60 connector male for battery
P13 = Header 2X2 right angle: Header, 4-Pin, 2X2 right angle; LatestRevisionDate: 17-Jul-2002; LatestRevisionNote: Re-released for DXP Platform.; Publisher: Altium Limited
P15 = Header 2 right angle: Header, 2-Pin right angle; LatestRevisionDate: 17-Jul-2002; LatestRevisionNote: Re-released for DXP Platform.; Publisher: Altium Limited
Q1 Q3 = IRF4905: HEXFET Power MOSFET; Note: Pin 2 is electrically connected to pin 4.; Published: 8-Jun-2000; LatestRevisionDate: 17-Jul-2002; LatestRevisionNote: Re-released for DXP Platform.; DatasheetVersion: Aug-1997; PackageVersion: Feb-1997; PackageReference: TO-220AB; Publisher: Altium Limited; PackageDescription: TO, Thru-Hole, Vertical, Heatsink Mounted; 3 In-Line Leads; Pitch 2.54 mm; ComponentLink1Description: Manufacturer Link; ComponentLink1URL: http://www.irf.com/; ComponentLink2Description: Datasheet; ComponentLink2URL: http://www.irf.com/product-info/datasheets/data/irf4905.pdf
Q2 = FDN360P: Mosfet
R23-R31 R50 R51 = ERJ6RS: as R19 on sheet Main sheet; Published: 17-Dec-2003; LatestRevisionDate: 19-Mar-2004; LatestRevisionNote: Silkscreen size reduced.; PackageDocument: Mar-2003; PackageReference: 6-0805; Publisher: Altium Limited; Code_IPC: 2012 [0805]; ComponentLink1Description: Manufacturer Link; ComponentLink1URL: http://www.panasonic.com/industrial/components/resistive_products.htm; ComponentLink2Description: Datasheet; ComponentLink2URL: http://www.panasonic.com/industrial/components/pdf/AOA0000CE3.pdf
R34 R35 = ERJ8RS: Low Ohmic Value Thick Film Chip Resistor, 0.1 Ohm to 0.2 Ohm Range, 1%, 2% and 5% Tolerance, 1206 Size, 0.25 W; Published: 17-Dec-2003; LatestRevisionDate: 19-Mar-2004; LatestRevisionNote: Silkscreen size reduced.; PackageDocument: Mar-2003; PackageReference: 8RB-1206; Publisher: Altium Limited; Code_IPC: 3216 [1206]; ComponentLink1Description: Manufacturer Link; ComponentLink1URL: http://www.panasonic.com/industrial/components/resistive_products.htm; ComponentLink2Description: Datasheet; ComponentLink2URL: http://www.panasonic.com/industrial/components/pdf/AOA0000CE3.pdf
SW1 SW2 = switch Power: switch power black 3A/250VAC
U1 = BeagleBoneBlackRevC
U5 = LM2576SX-5.0: SIMPLE SWITCHER® 3A Step-Down Voltage Regulator, 5-pin TO-263; Manufacturer: National Semiconductor; PackageTopMarking: NSUZXYTTE#*LM2576S*-5.0 P+; PowerWise: N; Published: 1-Mar-2010; DatasheetVersion: Aug-2004; PackageVersion: revD, Apr-2005; PackageReference: TS5B; Publisher: Altium Limited; PackageDescription: TO-263, Molded, .400 x .390 x .180in, 5 Lead, .067in Pitch, Surface Mount; PartNumber: LM2576SX-5.0; RoHS: N; PinCount: 5; CompType: Switcher; Code_JEDEC: MO-169-AB; ComponentLink1Description: LM2576 Datasheet; ComponentLink1URL: http://www.national.com/ds/LM/LM2576.pdf; ComponentLink2Description: LM2576 Web Page; ComponentLink2URL: http://www.national.com/pf/LM/LM2576.html; ComponentLink3Description: TS5B Package Page; ComponentLink3URL: http://www.national.com/packaging/folders/ts5b.html

## Nets that join several sheets
+3V3: Main sheet (R19.1 R20.1 R21.1 R22.1), Communication sheet (R6.1 R7.1), Switch sheet (15 pins), Power sheet (Q2.2 U1.903 U1.904)
+5V: Main sheet (P11.6), Communication sheet (19 pins), Extension sheet (P14.3 P14.4), Power sheet (10 pins)
+Motor: Extension sheet (8 pins), Power sheet (6 pins)
GND: Main sheet (P11.1), Communication sheet (16 pins), Switch sheet (18 pins), Extension sheet (10 pins), Power sheet (38 pins)
COM1-DataM: Communication sheet (R15.2 R17.1 U4.7), Extension sheet (P2.4 P3.4 P4.4 P5.4)
COM1-DataP: Communication sheet (R13.2 R15.1 U4.6), Extension sheet (P2.3 P3.3 P4.3 P5.3)
COM2-DataM: Communication sheet (5 pins), Extension sheet (P6.2 P7.4)
COM2-DataP: Communication sheet (5 pins), Extension sheet (P6.4 P7.3)
COM3-DataM: Communication sheet (5 pins), Extension sheet (P8.2 P9.4)
COM3-DataP: Communication sheet (5 pins), Extension sheet (P8.4 P9.3)
NetC21_2: Main sheet (U1.819), Switch sheet (C21.2 R37.2 S2.2)
NetC22_2: Main sheet (U1.817), Switch sheet (C22.2 R40.2 S4.2)
NetC23_2: Main sheet (U1.815), Switch sheet (C23.2 R43.2 S6.2)
NetC24_2: Switch sheet (C24.2 R45.1 S8.2), Power sheet (U1.910)
NetD24_2: Main sheet (U1.818), Switch sheet (D24.2)
NetD26_2: Main sheet (U1.816), Switch sheet (D26.2)
NetD27_2: Main sheet (U1.814), Switch sheet (D27.2)
NetD50_2: Communication sheet (U1.940), Power sheet (D50.2 R50.1 R51.2)
NetQ2_3: Main sheet (U1.941), Power sheet (Q2.3)
NetR48_1: Main sheet (U1.843), Switch sheet (R48.1)
NetS3_2: Main sheet (U1.811), Switch sheet (S3.2)
NetS5_2: Main sheet (U1.812), Switch sheet (S5.2)
NetS7_2: Main sheet (U1.826), Switch sheet (S7.2)